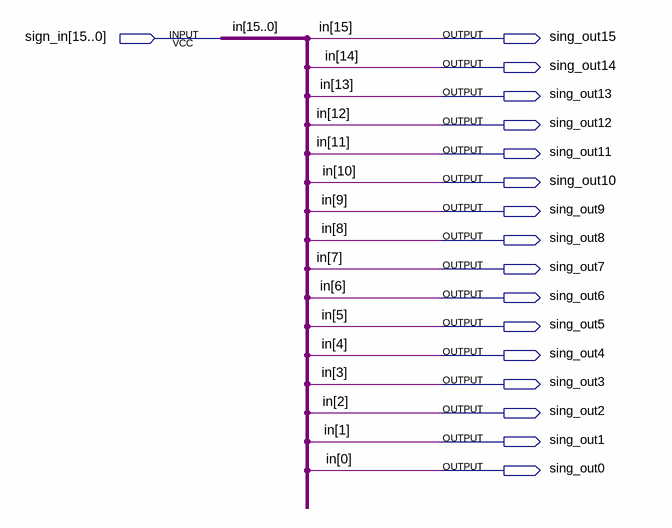
[diagram p0: schematic sheet]
// Quartus schematic sign_ext_helper.bdf as structural Verilog: 0 symbols, 17 pins
module sign_ext_helper (
  input  [15:0] sign_in,
  output sing_out15,
  output sing_out14,
  output sing_out13,
  output sing_out12,
  output sing_out11,
  output sing_out10,
  output sing_out9,
  output sing_out8,
  output sing_out7,
  output sing_out6,
  output sing_out5,
  output sing_out4,
  output sing_out3,
  output sing_out2,
  output sing_out1,
  output sing_out0
);


  assign sing_out0 = sign_in[0];
  assign sing_out1 = sign_in[1];
  assign sing_out2 = sign_in[2];
  assign sing_out3 = sign_in[3];
  assign sing_out4 = sign_in[4];
  assign sing_out5 = sign_in[5];
  assign sing_out6 = sign_in[6];
  assign sing_out7 = sign_in[7];
  assign sing_out8 = sign_in[8];
  assign sing_out9 = sign_in[9];
  assign sing_out10 = sign_in[10];
  assign sing_out11 = sign_in[11];
  assign sing_out12 = sign_in[12];
  assign sing_out13 = sign_in[13];
  assign sing_out14 = sign_in[14];
  assign sing_out15 = sign_in[15];

  // Other names for the same wires on the sheet: in[15:0] = sign_in
endmodule
